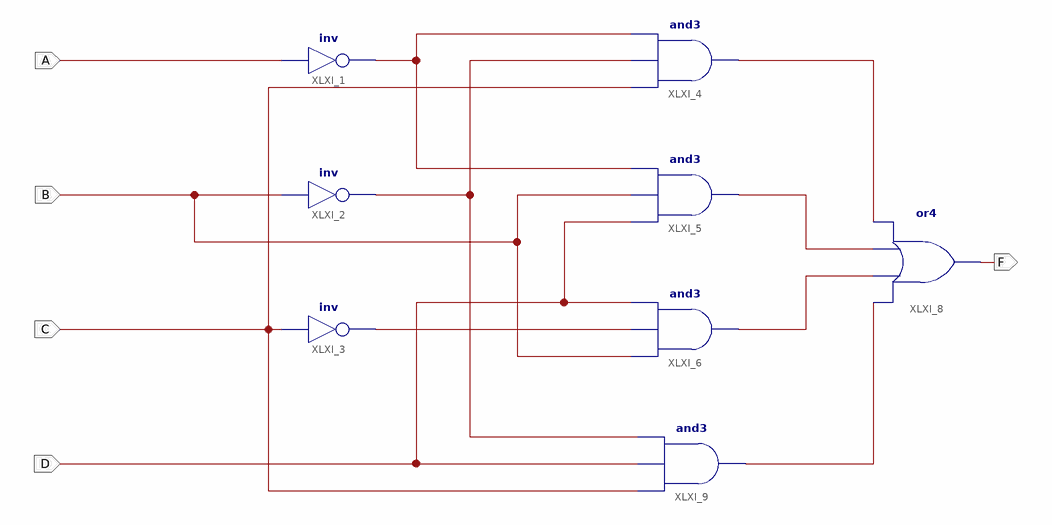
[diagram p0: schematic sheet 1]
// Xilinx ISE schematic Circuit_2.sch (spartan3e) as structural Verilog: 8 symbols, 5 ports
module Circuit_2 (
  input  D,
  input  A,
  input  B,
  input  C,
  output F
);

  wire XLXN_24, XLXN_26, XLXN_28, XLXN_41, XLXN_42, XLXN_43, XLXN_48;

  not XLXI_1 (XLXN_26, A);
  not XLXI_2 (XLXN_24, B);
  not XLXI_3 (XLXN_28, C);
  and XLXI_4 (XLXN_41, C, XLXN_24, XLXN_26);
  and XLXI_5 (XLXN_42, D, B, XLXN_26);
  and XLXI_6 (XLXN_43, B, XLXN_28, D);
  or XLXI_8 (F, XLXN_48, XLXN_43, XLXN_42, XLXN_41);
  and XLXI_9 (XLXN_48, C, D, XLXN_24);
endmodule
